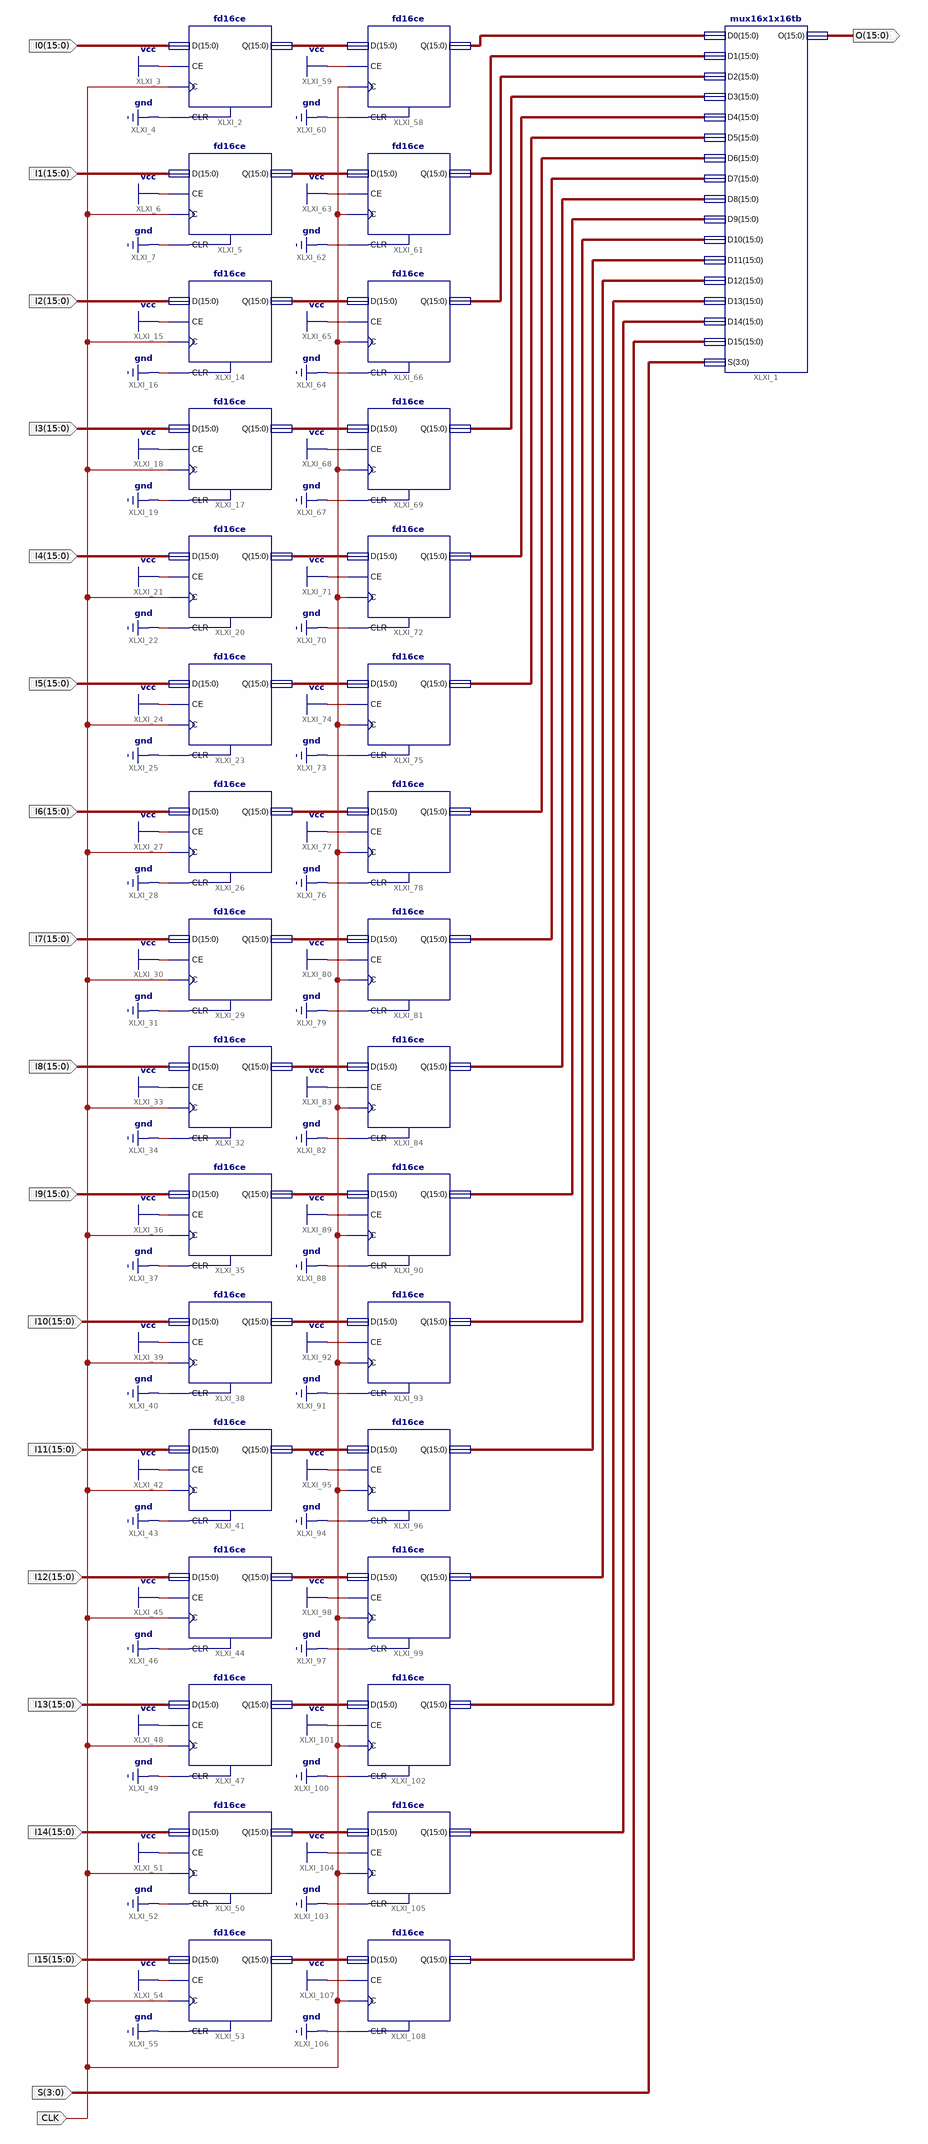
[diagram p0: schematic sheet 1]
// Xilinx ISE schematic inp_stab.sch (spartan6) as structural Verilog: 33 symbols, 19 ports
module inp_stab (
  input  [15:0] I0,
  input  [15:0] I1,
  input  [15:0] I2,
  input  [15:0] I3,
  input  [15:0] I4,
  input  [15:0] I5,
  input  [15:0] I6,
  input  [15:0] I7,
  input  [15:0] I8,
  input  [15:0] I9,
  input  [15:0] I10,
  input  [15:0] I11,
  input  [15:0] I12,
  input  [15:0] I13,
  input  [15:0] I14,
  input  [15:0] I15,
  input  CLK,
  input  [3:0] S,
  output [15:0] O
);

  wire [15:0] XLXN_72, XLXN_73, XLXN_75, XLXN_76, XLXN_77, XLXN_78, XLXN_79, XLXN_80, XLXN_81, XLXN_84,
       XLXN_85, XLXN_86, XLXN_87, XLXN_88, XLXN_89, XLXN_90, XLXN_137, XLXN_141, XLXN_145, XLXN_149,
       XLXN_153, XLXN_157, XLXN_161, XLXN_165, XLXN_169, XLXN_177, XLXN_181, XLXN_185, XLXN_189, XLXN_193,
       XLXN_197, XLXN_201;

  fd16ce XLXI_2 (.C(CLK), .CE(1'b1), .CLR(1'b0), .D(I0), .Q(XLXN_137));
  fd16ce XLXI_5 (.C(CLK), .CE(1'b1), .CLR(1'b0), .D(I1), .Q(XLXN_141));
  fd16ce XLXI_14 (.C(CLK), .CE(1'b1), .CLR(1'b0), .D(I2), .Q(XLXN_145));
  fd16ce XLXI_17 (.C(CLK), .CE(1'b1), .CLR(1'b0), .D(I3), .Q(XLXN_149));
  fd16ce XLXI_20 (.C(CLK), .CE(1'b1), .CLR(1'b0), .D(I4), .Q(XLXN_153));
  fd16ce XLXI_23 (.C(CLK), .CE(1'b1), .CLR(1'b0), .D(I5), .Q(XLXN_157));
  fd16ce XLXI_26 (.C(CLK), .CE(1'b1), .CLR(1'b0), .D(I6), .Q(XLXN_161));
  fd16ce XLXI_29 (.C(CLK), .CE(1'b1), .CLR(1'b0), .D(I7), .Q(XLXN_165));
  fd16ce XLXI_32 (.C(CLK), .CE(1'b1), .CLR(1'b0), .D(I8), .Q(XLXN_169));
  fd16ce XLXI_35 (.C(CLK), .CE(1'b1), .CLR(1'b0), .D(I9), .Q(XLXN_177));
  fd16ce XLXI_38 (.C(CLK), .CE(1'b1), .CLR(1'b0), .D(I10), .Q(XLXN_181));
  fd16ce XLXI_41 (.C(CLK), .CE(1'b1), .CLR(1'b0), .D(I11), .Q(XLXN_185));
  fd16ce XLXI_44 (.C(CLK), .CE(1'b1), .CLR(1'b0), .D(I12), .Q(XLXN_189));
  fd16ce XLXI_47 (.C(CLK), .CE(1'b1), .CLR(1'b0), .D(I13), .Q(XLXN_193));
  fd16ce XLXI_50 (.C(CLK), .CE(1'b1), .CLR(1'b0), .D(I14), .Q(XLXN_197));
  fd16ce XLXI_53 (.C(CLK), .CE(1'b1), .CLR(1'b0), .D(I15), .Q(XLXN_201));
  mux16x1x16tb XLXI_1 (
    .D0(XLXN_72), .D1(XLXN_73), .D10(XLXN_85), .D11(XLXN_86), .D12(XLXN_87), .D13(XLXN_88), .D14(XLXN_89),
    .D15(XLXN_90), .D2(XLXN_75), .D3(XLXN_76), .D4(XLXN_77), .D5(XLXN_78), .D6(XLXN_79), .D7(XLXN_80),
    .D8(XLXN_81), .D9(XLXN_84), .O(O), .S(S));
  fd16ce XLXI_58 (.C(CLK), .CE(1'b1), .CLR(1'b0), .D(XLXN_137), .Q(XLXN_72));
  fd16ce XLXI_61 (.C(CLK), .CE(1'b1), .CLR(1'b0), .D(XLXN_141), .Q(XLXN_73));
  fd16ce XLXI_66 (.C(CLK), .CE(1'b1), .CLR(1'b0), .D(XLXN_145), .Q(XLXN_75));
  fd16ce XLXI_69 (.C(CLK), .CE(1'b1), .CLR(1'b0), .D(XLXN_149), .Q(XLXN_76));
  fd16ce XLXI_72 (.C(CLK), .CE(1'b1), .CLR(1'b0), .D(XLXN_153), .Q(XLXN_77));
  fd16ce XLXI_75 (.C(CLK), .CE(1'b1), .CLR(1'b0), .D(XLXN_157), .Q(XLXN_78));
  fd16ce XLXI_78 (.C(CLK), .CE(1'b1), .CLR(1'b0), .D(XLXN_161), .Q(XLXN_79));
  fd16ce XLXI_81 (.C(CLK), .CE(1'b1), .CLR(1'b0), .D(XLXN_165), .Q(XLXN_80));
  fd16ce XLXI_84 (.C(CLK), .CE(1'b1), .CLR(1'b0), .D(XLXN_169), .Q(XLXN_81));
  fd16ce XLXI_90 (.C(CLK), .CE(1'b1), .CLR(1'b0), .D(XLXN_177), .Q(XLXN_84));
  fd16ce XLXI_93 (.C(CLK), .CE(1'b1), .CLR(1'b0), .D(XLXN_181), .Q(XLXN_85));
  fd16ce XLXI_96 (.C(CLK), .CE(1'b1), .CLR(1'b0), .D(XLXN_185), .Q(XLXN_86));
  fd16ce XLXI_99 (.C(CLK), .CE(1'b1), .CLR(1'b0), .D(XLXN_189), .Q(XLXN_87));
  fd16ce XLXI_102 (.C(CLK), .CE(1'b1), .CLR(1'b0), .D(XLXN_193), .Q(XLXN_88));
  fd16ce XLXI_105 (.C(CLK), .CE(1'b1), .CLR(1'b0), .D(XLXN_197), .Q(XLXN_89));
  fd16ce XLXI_108 (.C(CLK), .CE(1'b1), .CLR(1'b0), .D(XLXN_201), .Q(XLXN_90));
endmodule
